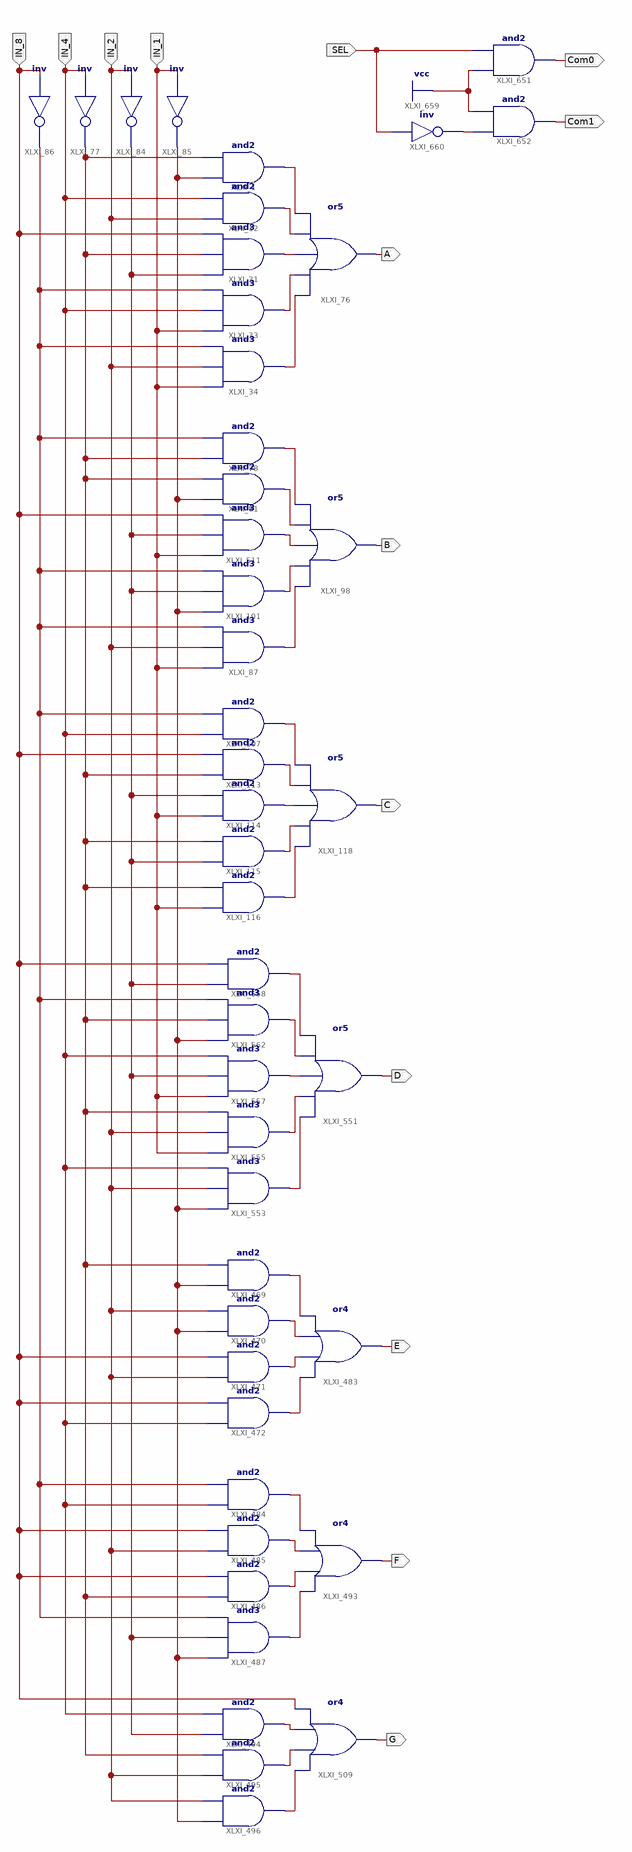
[diagram p0: schematic sheet 1]
// Xilinx ISE schematic BCDtoSegment.sch (spartan6) as structural Verilog: 45 symbols, 14 ports
module BCDtoSegment (
  input  IN_8,
  input  IN_4,
  input  IN_2,
  input  IN_1,
  input  SEL,
  output A,
  output B,
  output C,
  output D,
  output E,
  output F,
  output G,
  output Com1,
  output Com0
);

  wire XLXN_96, XLXN_98, XLXN_99, XLXN_100, XLXN_101, XLXN_136, XLXN_137, XLXN_138, XLXN_139, XLXN_142,
       XLXN_171, XLXN_172, XLXN_173, XLXN_175, XLXN_176, XLXN_669, XLXN_670, XLXN_671, XLXN_672, XLXN_696,
       XLXN_697, XLXN_698, XLXN_699, XLXN_723, XLXN_724, XLXN_725, XLXN_740, XLXN_744, XLXN_747, XLXN_750,
       XLXN_903, XLXN_904, XLXN_905, XLXN_906, XLXN_907, XLXN_1128;

  not XLXI_77 (XLXN_740, IN_4);
  not XLXI_84 (XLXN_747, IN_2);
  not XLXI_85 (XLXN_744, IN_1);
  not XLXI_86 (XLXN_750, IN_8);
  and XLXI_1 (XLXN_96, XLXN_744, XLXN_740);
  or XLXI_76 (A, XLXN_101, XLXN_100, XLXN_99, XLXN_98, XLXN_96);
  and XLXI_33 (XLXN_100, IN_1, IN_4, XLXN_750);
  and XLXI_31 (XLXN_99, XLXN_747, XLXN_740, IN_8);
  and XLXI_12 (XLXN_98, IN_2, IN_4);
  and XLXI_34 (XLXN_101, IN_1, IN_2, XLXN_750);
  and XLXI_78 (XLXN_139, XLXN_740, XLXN_750);
  and XLXI_81 (XLXN_137, XLXN_744, XLXN_740);
  and XLXI_101 (XLXN_142, XLXN_744, XLXN_747, XLXN_750);
  and XLXI_87 (XLXN_138, IN_1, IN_2, XLXN_750);
  or XLXI_98 (B, XLXN_138, XLXN_142, XLXN_136, XLXN_137, XLXN_139);
  and XLXI_511 (XLXN_136, IN_1, XLXN_747, IN_8);
  or XLXI_118 (C, XLXN_176, XLXN_175, XLXN_171, XLXN_172, XLXN_173);
  and XLXI_114 (XLXN_171, IN_1, XLXN_747);
  and XLXI_113 (XLXN_172, XLXN_740, IN_8);
  and XLXI_107 (XLXN_173, IN_4, XLXN_750);
  and XLXI_115 (XLXN_175, XLXN_747, XLXN_740);
  and XLXI_116 (XLXN_176, IN_1, XLXN_740);
  and XLXI_553 (XLXN_906, XLXN_744, IN_2, IN_4);
  and XLXI_558 (XLXN_907, XLXN_747, IN_8);
  and XLXI_562 (XLXN_904, XLXN_744, XLXN_740, XLXN_750);
  and XLXI_557 (XLXN_905, IN_1, XLXN_747, IN_4);
  and XLXI_555 (XLXN_903, IN_1, IN_2, XLXN_740);
  or XLXI_551 (D, XLXN_906, XLXN_903, XLXN_905, XLXN_904, XLXN_907);
  or XLXI_483 (E, XLXN_671, XLXN_670, XLXN_669, XLXN_672);
  and XLXI_472 (XLXN_671, IN_4, IN_8);
  and XLXI_471 (XLXN_670, IN_2, IN_8);
  and XLXI_470 (XLXN_669, XLXN_744, IN_2);
  and XLXI_469 (XLXN_672, XLXN_744, XLXN_740);
  or XLXI_493 (F, XLXN_698, XLXN_697, XLXN_696, XLXN_699);
  or XLXI_509 (G, XLXN_725, XLXN_724, XLXN_723, IN_8);
  and XLXI_484 (XLXN_699, IN_4, XLXN_750);
  and XLXI_485 (XLXN_696, IN_2, IN_8);
  and XLXI_486 (XLXN_697, XLXN_740, IN_8);
  and XLXI_487 (XLXN_698, XLXN_744, XLXN_747, XLXN_750);
  and XLXI_494 (XLXN_723, XLXN_747, IN_4);
  and XLXI_495 (XLXN_724, IN_2, XLXN_740);
  and XLXI_496 (XLXN_725, XLXN_744, IN_2);
  and XLXI_651 (Com0, 1'b1, SEL);
  and XLXI_652 (Com1, XLXN_1128, 1'b1);
  not XLXI_660 (XLXN_1128, SEL);
endmodule
